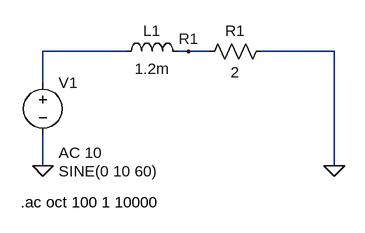
[diagram p0: schematic rl_circuit.asc]
rl_circuit.asc, the LTspice schematic file:
Version 4
SHEET 1 880 680
WIRE 128 128 0 128
WIRE 224 128 208 128
WIRE 256 128 224 128
WIRE 448 128 336 128
WIRE 0 176 0 128
WIRE 0 304 0 256
WIRE 448 304 448 128
FLAG 448 304 0
FLAG 0 304 0
FLAG 224 128 R1
SYMBOL ind 112 144 R270
WINDOW 0 32 56 VTop 2
WINDOW 3 5 56 VBottom 2
SYMATTR InstName L1
SYMATTR Value 1.2m
SYMBOL res 240 144 R270
WINDOW 0 32 56 VTop 2
WINDOW 3 0 56 VBottom 2
SYMATTR InstName R1
SYMATTR Value 2
SYMBOL voltage 0 160 R0
WINDOW 3 24 152 Left 2
WINDOW 123 24 124 Left 2
WINDOW 39 0 0 Left 0
SYMATTR InstName V1
SYMATTR Value SINE(0 10 60)
SYMATTR Value2 AC 10
TEXT -34 360 Left 2 !.ac oct 100 1 10000

The netlist it stands for:
* rl_circuit.asc
L1 N001 R1 1.2m
R1 R1 0 2
V1 N001 0 SINE(0 10 60) AC 10
.ac oct 100 1 10000
.backanno
.end